# EAGLE schematic MinSys atmega (EAGLE 7.2.0)
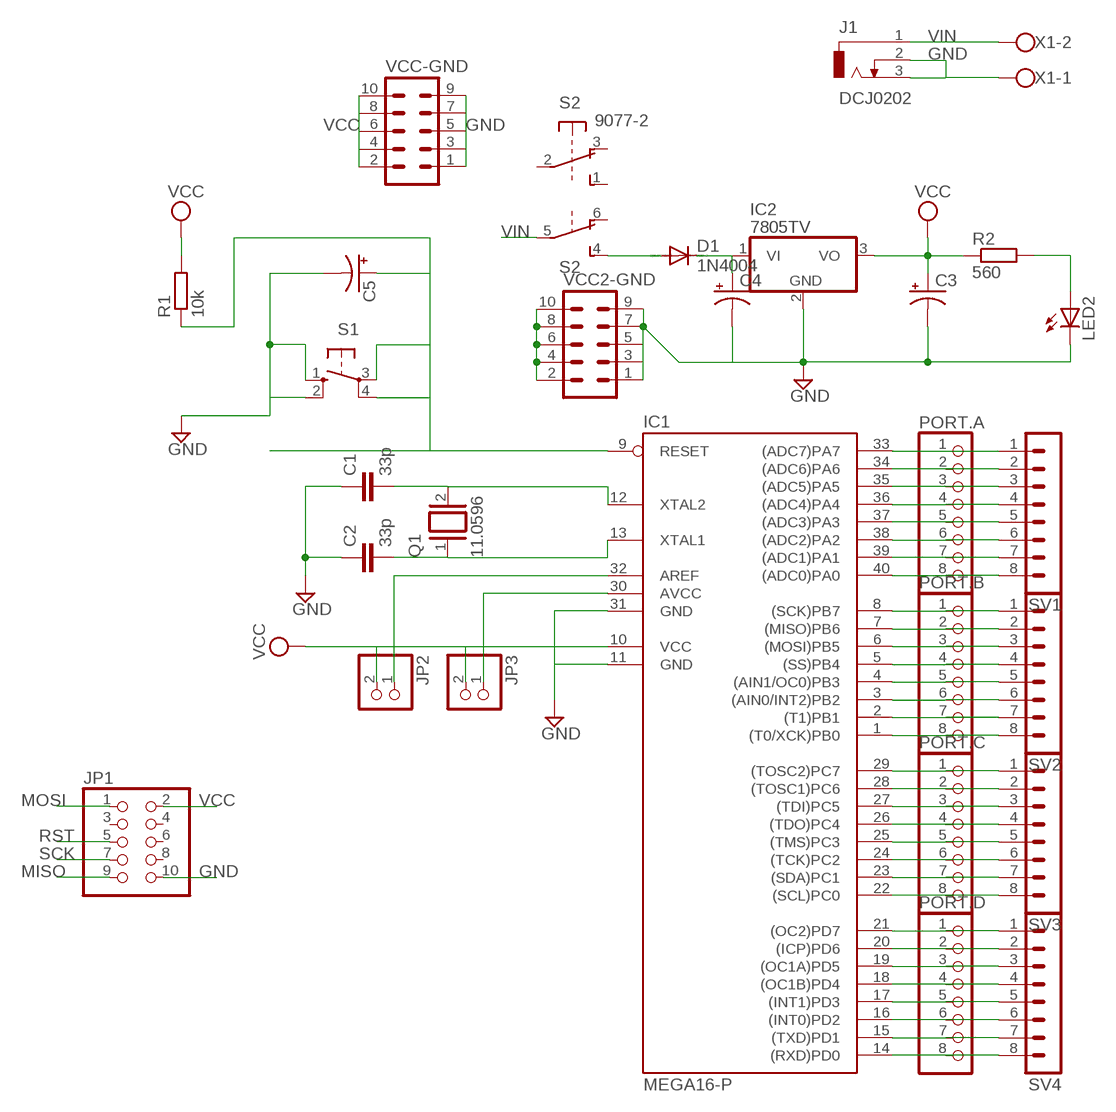
[diagram p0: schematic, sheet 1]

## Parts
C1  33p  C2,5-3  [C2.5-3]
C2  33p  C2,5-3  [C2.5-3]
C3  CPOL-USE2,5-6E  [E2,5-6E]
C4  CPOL-USE2,5-6E  [E2,5-6E]
C5  CPOL-USE2.5-6  [E2,5-6]
D1  1N4004  [DO41-10]
IC1  MEGA16-P  [DIL40]
IC2  7805TV  [TO220V]
J1  DCJ0202  [DCJ0202]
JP1  PINHD-2X5  [2X05]
JP2  PINHD-1X2  [1X02]
JP3  PINHD-1X2  [1X02]
LED2  LED3MM  [LED3MM]
PORT.A  PINHD-1X8  [1X08]
PORT.B  PINHD-1X8  [1X08]
PORT.C  PINHD-1X8  [1X08]
PORT.D  PINHD-1X8  [1X08]
Q1  11.0596  XTAL/S  [QS]
R1  10k  R-EU_0207/10  [0207/10]
R2  560  R-EU_0207/10  [0207/10]
S1  10-XX  [B3F-10XX]
S2  9077-2  [9077-2]
SV1  MA08-1  [MA08-1]
SV2  MA08-1  [MA08-1]
SV3  MA08-1  [MA08-1]
SV4  MA08-1  [MA08-1]
VCC2-GND  MA05-2  [MA05-2]
VCC-GND  MA05-2  [MA05-2]
X1  W237-102  [W237-102]

## Nets
GND: C1.1 C2.1 C3.- C4.- C5.- IC1.11(GND) IC1.31(GND) IC2.2(GND) J1.2 J1.3 JP1.10 LED2.K(C) S1.1(S) S1.2(S1) VCC2-GND.1 VCC2-GND.3 VCC2-GND.5 VCC2-GND.7 VCC2-GND.9 VCC-GND.1 VCC-GND.3 VCC-GND.5 VCC-GND.7 VCC-GND.9 X1.1
MISO: IC1.7((MISO)PB6) JP1.9 PORT.B.2 SV2.2
MOSI: IC1.6((MOSI)PB5) JP1.1 PORT.B.3 SV2.3
N$1: IC1.33((ADC7)PA7) PORT.A.1 SV1.1
N$2: D1.A S2.4(2:S)
N$3: IC1.34((ADC6)PA6) PORT.A.2 SV1.2
N$4: IC1.32(AREF) JP2.1
N$5: IC1.30(AVCC) JP3.1
N$9: C1.2 IC1.12(XTAL2) Q1.2
N$10: C2.2 IC1.13(XTAL1) Q1.1
N$36: C4.+ D1.C IC2.1(VI)
N$41: LED2.A R2.2
P02: IC1.35((ADC5)PA5) PORT.A.3 SV1.3
P03: IC1.36((ADC4)PA4) PORT.A.4 SV1.4
P04: IC1.37((ADC3)PA3) PORT.A.5 SV1.5
P05: IC1.38((ADC2)PA2) PORT.A.6 SV1.6
P06: IC1.39((ADC1)PA1) PORT.A.7 SV1.7
P07: IC1.40((ADC0)PA0) PORT.A.8 SV1.8
P10: IC1.14((RXD)PD0) PORT.D.8 SV4.8
P11: IC1.15((TXD)PD1) PORT.D.7 SV4.7
P12: IC1.16((INT0)PD2) PORT.D.6 SV4.6
P13: IC1.17((INT1)PD3) PORT.D.5 SV4.5
P14: IC1.18((OC1B)PD4) PORT.D.4 SV4.4
P15: IC1.19((OC1A)PD5) PORT.D.3 SV4.3
P16: IC1.20((ICP)PD6) PORT.D.2 SV4.2
P17: IC1.21((OC2)PD7) PORT.D.1 SV4.1
P23: IC1.5((SS)PB4) PORT.B.4 SV2.4
P24: IC1.4((AIN1/OC0)PB3) PORT.B.5 SV2.5
P25: IC1.3((AIN0/INT2)PB2) PORT.B.6 SV2.6
P26: IC1.2((T1)PB1) PORT.B.7 SV2.7
P27: IC1.1((T0/XCK)PB0) PORT.B.8 SV2.8
P30: IC1.22((SCL)PC0) PORT.C.8 SV3.8
P31: IC1.23((SDA)PC1) PORT.C.7 SV3.7
P32: IC1.24((TCK)PC2) PORT.C.6 SV3.6
P33: IC1.25((TMS)PC3) PORT.C.5 SV3.5
P34: IC1.26((TDO)PC4) PORT.C.4 SV3.4
P35: IC1.27((TDI)PC5) PORT.C.3 SV3.3
P36: IC1.28((TOSC1)PC6) PORT.C.2 SV3.2
P37: IC1.29((TOSC2)PC7) PORT.C.1 SV3.1
RST: C5.+ IC1.9(RESET) JP1.5 R1.1 S1.3(P) S1.4(P1)
SCK: IC1.8((SCK)PB7) JP1.7 PORT.B.1 SV2.1
VCC: C3.+ IC1.10(VCC) IC2.3(VO) JP1.2 JP2.2 JP3.2 R1.2 R2.1 VCC2-GND.2 VCC2-GND.4 VCC2-GND.6 VCC2-GND.8 VCC2-GND.10 VCC-GND.2 VCC-GND.4 VCC-GND.6 VCC-GND.8 VCC-GND.10
VIN: J1.1 S2.5(2:P) X1.2
Unconnected: JP1.3 JP1.4 JP1.6 JP1.8 S2.1(1:S) S2.2(1:P) S2.3(1:O) S2.6(2:O)

## Library data of the parts
C1 C2 = capacitor-wima:C: CAPACITOR naming: grid - package width
C3-C5 = rcl:CPOL-US: POLARIZED CAPACITOR, American symbol
D1 = diode:1N4004: DIODE general purpose rectifier, 1 A
IC1 = atmel:MEGA16-P: MICROCONTROLLER 16 Kbytes FLASH 1 kbytes SRAM 512 bytes EEPROM USART 8-channel 10 bit ADC Source: avr.lbr; MPN: ATMEGA16-16PU; OC_FARNELL: 9171142; OC_NEWARK: 01M6885
IC2 = linear:78*: Positive VOLTAGE REGULATOR Source: http://cache.national.com/ds/LM/LM78L05.pdf http://www.fairchildsemi.com/ds/LM/LM7805.pdf
J1 = con-jack:DCJ0202: DC POWER JACK Source: DCJ0202.pdf; OC_FARNELL: unknown; OC_NEWARK: unknown
JP1 = pinhead:PINHD-2X5: PIN HEADER
JP2 JP3 = pinhead:PINHD-1X2: PIN HEADER
LED2 = led:LED: LED OSRAM: - CHIPLED LG R971, LG N971, LY N971, LG Q971, LY Q971, LO R971, LY R971 LH N974, LH R974 LS Q976, LO Q976, LY Q976 LO Q996 - Hyper CHIPLED LW Q18S LB Q993, LB Q99A, LB R99A - SideLED LS A670, LO A670, LY A670, LG A670, LP A670 LB A673, LV A673, LT A673, LW A673 LH A674 LY A675 LS A676, LA A676, LO A676, LY A676, LW A676 LS A679, LY A679, LG A679 - Hyper Micro SIDELED® LS Y876, LA Y876, LO Y876, LY Y876 LT Y87S - SmartLED LW L88C, LW L88S LB L89C, LB L89S, LG L890 LS L89K, LO L89K, LY L89K LS L896, LA L896, LO L896, LY L896 - TOPLED LS T670, LO T670, LY T670, LG T670, LP T670 LSG T670, LSP T670, LSY T670, LOP T670, LYG T670 LG T671, LOG T671, LSG T671 LB T673, LV T673, LT T673, LW T673 LH T674 LS T676, LA T676, LO T676, LY T676, LB T676, LH T676, LSB T676, LW T676 LB T67C, LV T67C, LT T67C, LS T67K, LO T67K, LY T67K, LW E67C LS E67B, LA E67B, LO E67B, LY E67B, LB E67C, LV E67C, LT E67C LW T67C LS T679, LY T679, LG T679 LS T770, LO T770, LY T770, LG T770, LP T770 LB T773, LV T773, LT T773, LW T773 LH T774 LS E675, LA E675, LY E675, LS T675 LS T776, LA T776, LO T776, LY T776, LB T776 LHGB T686 LT T68C, LB T68C - Hyper Mini TOPLED® LB M676 - Mini TOPLED Santana® LG M470 LS M47K, LO M47K, LY M47K Source: http://www.osram.convergy.de LUXEON: - LUMILED® LXK2-PW12-R00, LXK2-PW12-S00, LXK2-PW14-U00, LXK2-PW14-V00 LXK2-PM12-R00, LXK2-PM12-S00, LXK2-PM14-U00 LXK2-PE12-Q00, LXK2-PE12-R00, LXK2-PE12-S00, LXK2-PE14-T00, LXK2-PE14-U00 LXK2-PB12-K00, LXK2-PB12-L00, LXK2-PB12-M00, LXK2-PB14-N00, LXK2-PB14-P00, LXK2-PB14-Q00 LXK2-PR12-L00, LXK2-PR12-M00, LXK2-PR14-Q00, LXK2-PR14-R00 LXK2-PD12-Q00, LXK2-PD12-R00, LXK2-PD12-S00 LXK2-PH12-R00, LXK2-PH12-S00 LXK2-PL12-P00, LXK2-PL12-Q00, LXK2-PL12-R00 Source: www.luxeon.com KINGBRIGHT: KA-3528ASYC Source: www.kingbright.com
PORT.A PORT.B PORT.C PORT.D = pinhead:PINHD-1X8: PIN HEADER
Q1 = special:XTAL/S: CRYSTAL
R1 = rcl:R-EU_: RESISTOR, European symbol
R2 = resistor:R-EU_: RESISTOR, European symbol
S1 = switch-omron:10-XX: OMRON SWITCH; MPN: B3F-1000; OC_FARNELL: 176432; OC_NEWARK: 36M3542
S2 = switch-misc:9077-2: MARQUARDT SWITCH 9077.0200 Distributor: Buerklin <https://www.buerklin.com/default.asp?event=ShowArtikel%2812G2822%29&l=d&jump=ArtNr_12G2822>
SV1-SV4 = con-lstb:MA08-1: PIN HEADER; OC_FARNELL: unknown; OC_NEWARK: unknown
VCC2-GND VCC-GND = con-lstb:MA05-2: PIN HEADER; OC_FARNELL: unknown; OC_NEWARK: unknown
X1 = con-wago-500:W237-102: WAGO SCREW CLAMP; MPN: 237-102; OC_FARNELL: unknown; OC_NEWARK: 70K9898